# EAGLE schematic main_board_rev_1 (EAGLE 9.6.2)
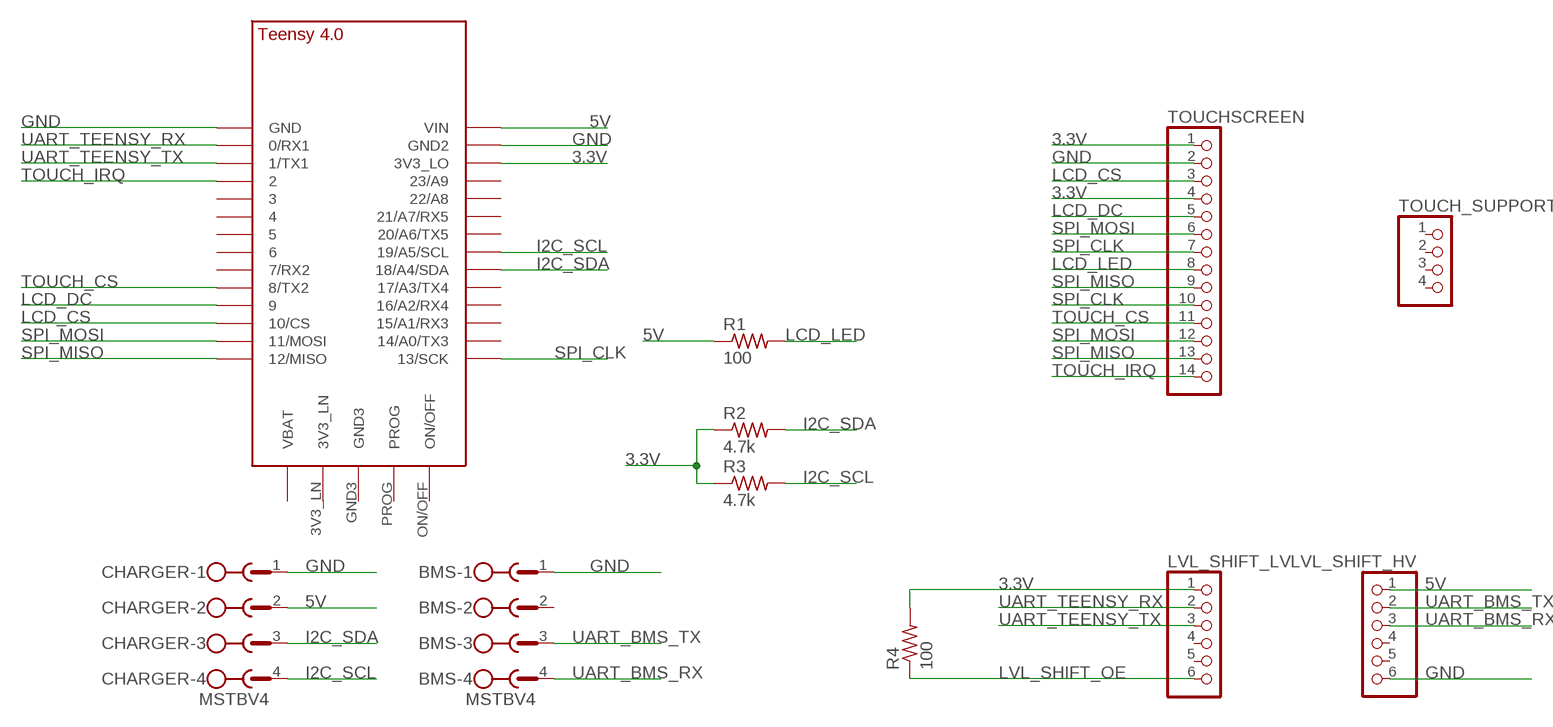
[diagram p0: schematic, sheet 1]

## Parts
BMS  MSTBV4  [MSTBV4]
CHARGER  MSTBV4  [MSTBV4]
LVL_SHIFT_HV  PINHD-1X6  [1X06]
LVL_SHIFT_LV  PINHD-1X6  [1X06]
R1  100  R-US_0204/7  [0204/7]
R2  4.7k  R-US_0204/7  [0204/7]
R3  4.7k  R-US_0204/7  [0204/7]
R4  100  R-US_0204/7  [0204/7]
TOUCH_SUPPORT  PINHD-1X4  [1X04]
TOUCHSCREEN  PINHD-1X14  [1X14]
U$1  TEENSY_4.0-BASIC  [TEENSY_4.0-BASIC]

## Nets
3.3V: LVL_SHIFT_LV.1 R2.1 R3.1 R4.2 TOUCHSCREEN.1 TOUCHSCREEN.4 U$1.3V3_LO
5V: CHARGER.2 LVL_SHIFT_HV.1 R1.1 U$1.VIN
GND: BMS.1 CHARGER.1 LVL_SHIFT_HV.6 TOUCHSCREEN.2 U$1.GND U$1.GND2
I2C_SCL: CHARGER.4 R3.2 U$1.19/A5/SCL
I2C_SDA: CHARGER.3 R2.2 U$1.18/A4/SDA
LCD_CS: TOUCHSCREEN.3 U$1.10/CS
LCD_DC: TOUCHSCREEN.5 U$1.9/CS
LCD_LED: R1.2 TOUCHSCREEN.8
LVL_SHIFT_OE: LVL_SHIFT_LV.6 R4.1
SPI_CLK: TOUCHSCREEN.7 TOUCHSCREEN.10 U$1.13/SCK
SPI_MISO: TOUCHSCREEN.9 TOUCHSCREEN.13 U$1.12/MISO
SPI_MOSI: TOUCHSCREEN.6 TOUCHSCREEN.12 U$1.11/MOSI
TOUCH_CS: TOUCHSCREEN.11 U$1.8(8/TX2)
TOUCH_IRQ: TOUCHSCREEN.14 U$1.2
UART_BMS_RX: BMS.4 LVL_SHIFT_HV.3
UART_BMS_TX: BMS.3 LVL_SHIFT_HV.2
UART_TEENSY_RX: LVL_SHIFT_LV.2 U$1.0/RX(0/RX1)
UART_TEENSY_TX: LVL_SHIFT_LV.3 U$1.1/TX(1/TX1)
Unconnected: BMS.2 LVL_SHIFT_HV.4 LVL_SHIFT_HV.5 LVL_SHIFT_LV.4 LVL_SHIFT_LV.5 TOUCH_SUPPORT.1 TOUCH_SUPPORT.2 TOUCH_SUPPORT.3 TOUCH_SUPPORT.4 U$1.3/CANTX U$1.3V3_LN U$1.4/CANRX U$1.5 U$1.6 U$1.7(7/RX2) U$1.14/A0(14/A0/TX3) U$1.15/A1(15/A1/RX3) U$1.16/A2(16/A2/RX4) U$1.17/A3(17/A3/TX4) U$1.20/A6(20/A6/TX5) U$1.21/A7(21/A7/RX5) U$1.22/A8 U$1.23/A9 U$1.GND3 U$1.ON/OFF U$1.PROG U$1.VBAT\(VBAT)

## Library data of the parts
BMS CHARGER = con-phoenix-508:MSTBV4: PHOENIX; MPN: MSTBV 2,5/4-GF-5.08; OC_FARNELL: 1792794; OC_NEWARK: 69R9847
LVL_SHIFT_HV LVL_SHIFT_LV = pinhead:PINHD-1X6: PIN HEADER
R1-R4 = rcl:R-US_: RESISTOR, American symbol; SPICEPREFIX: R
TOUCH_SUPPORT = pinhead:PINHD-1X4: PIN HEADER
TOUCHSCREEN = pinhead:PINHD-1X14: PIN HEADER
U$1 = Teensy-4.0:TEENSY_4.0-BASIC